# Altium schematic sheet lab3_kozlov_motherboard.SchDoc: =title_line_1 + title_line_2
size 840 x 594 mm; SheetNumber: n
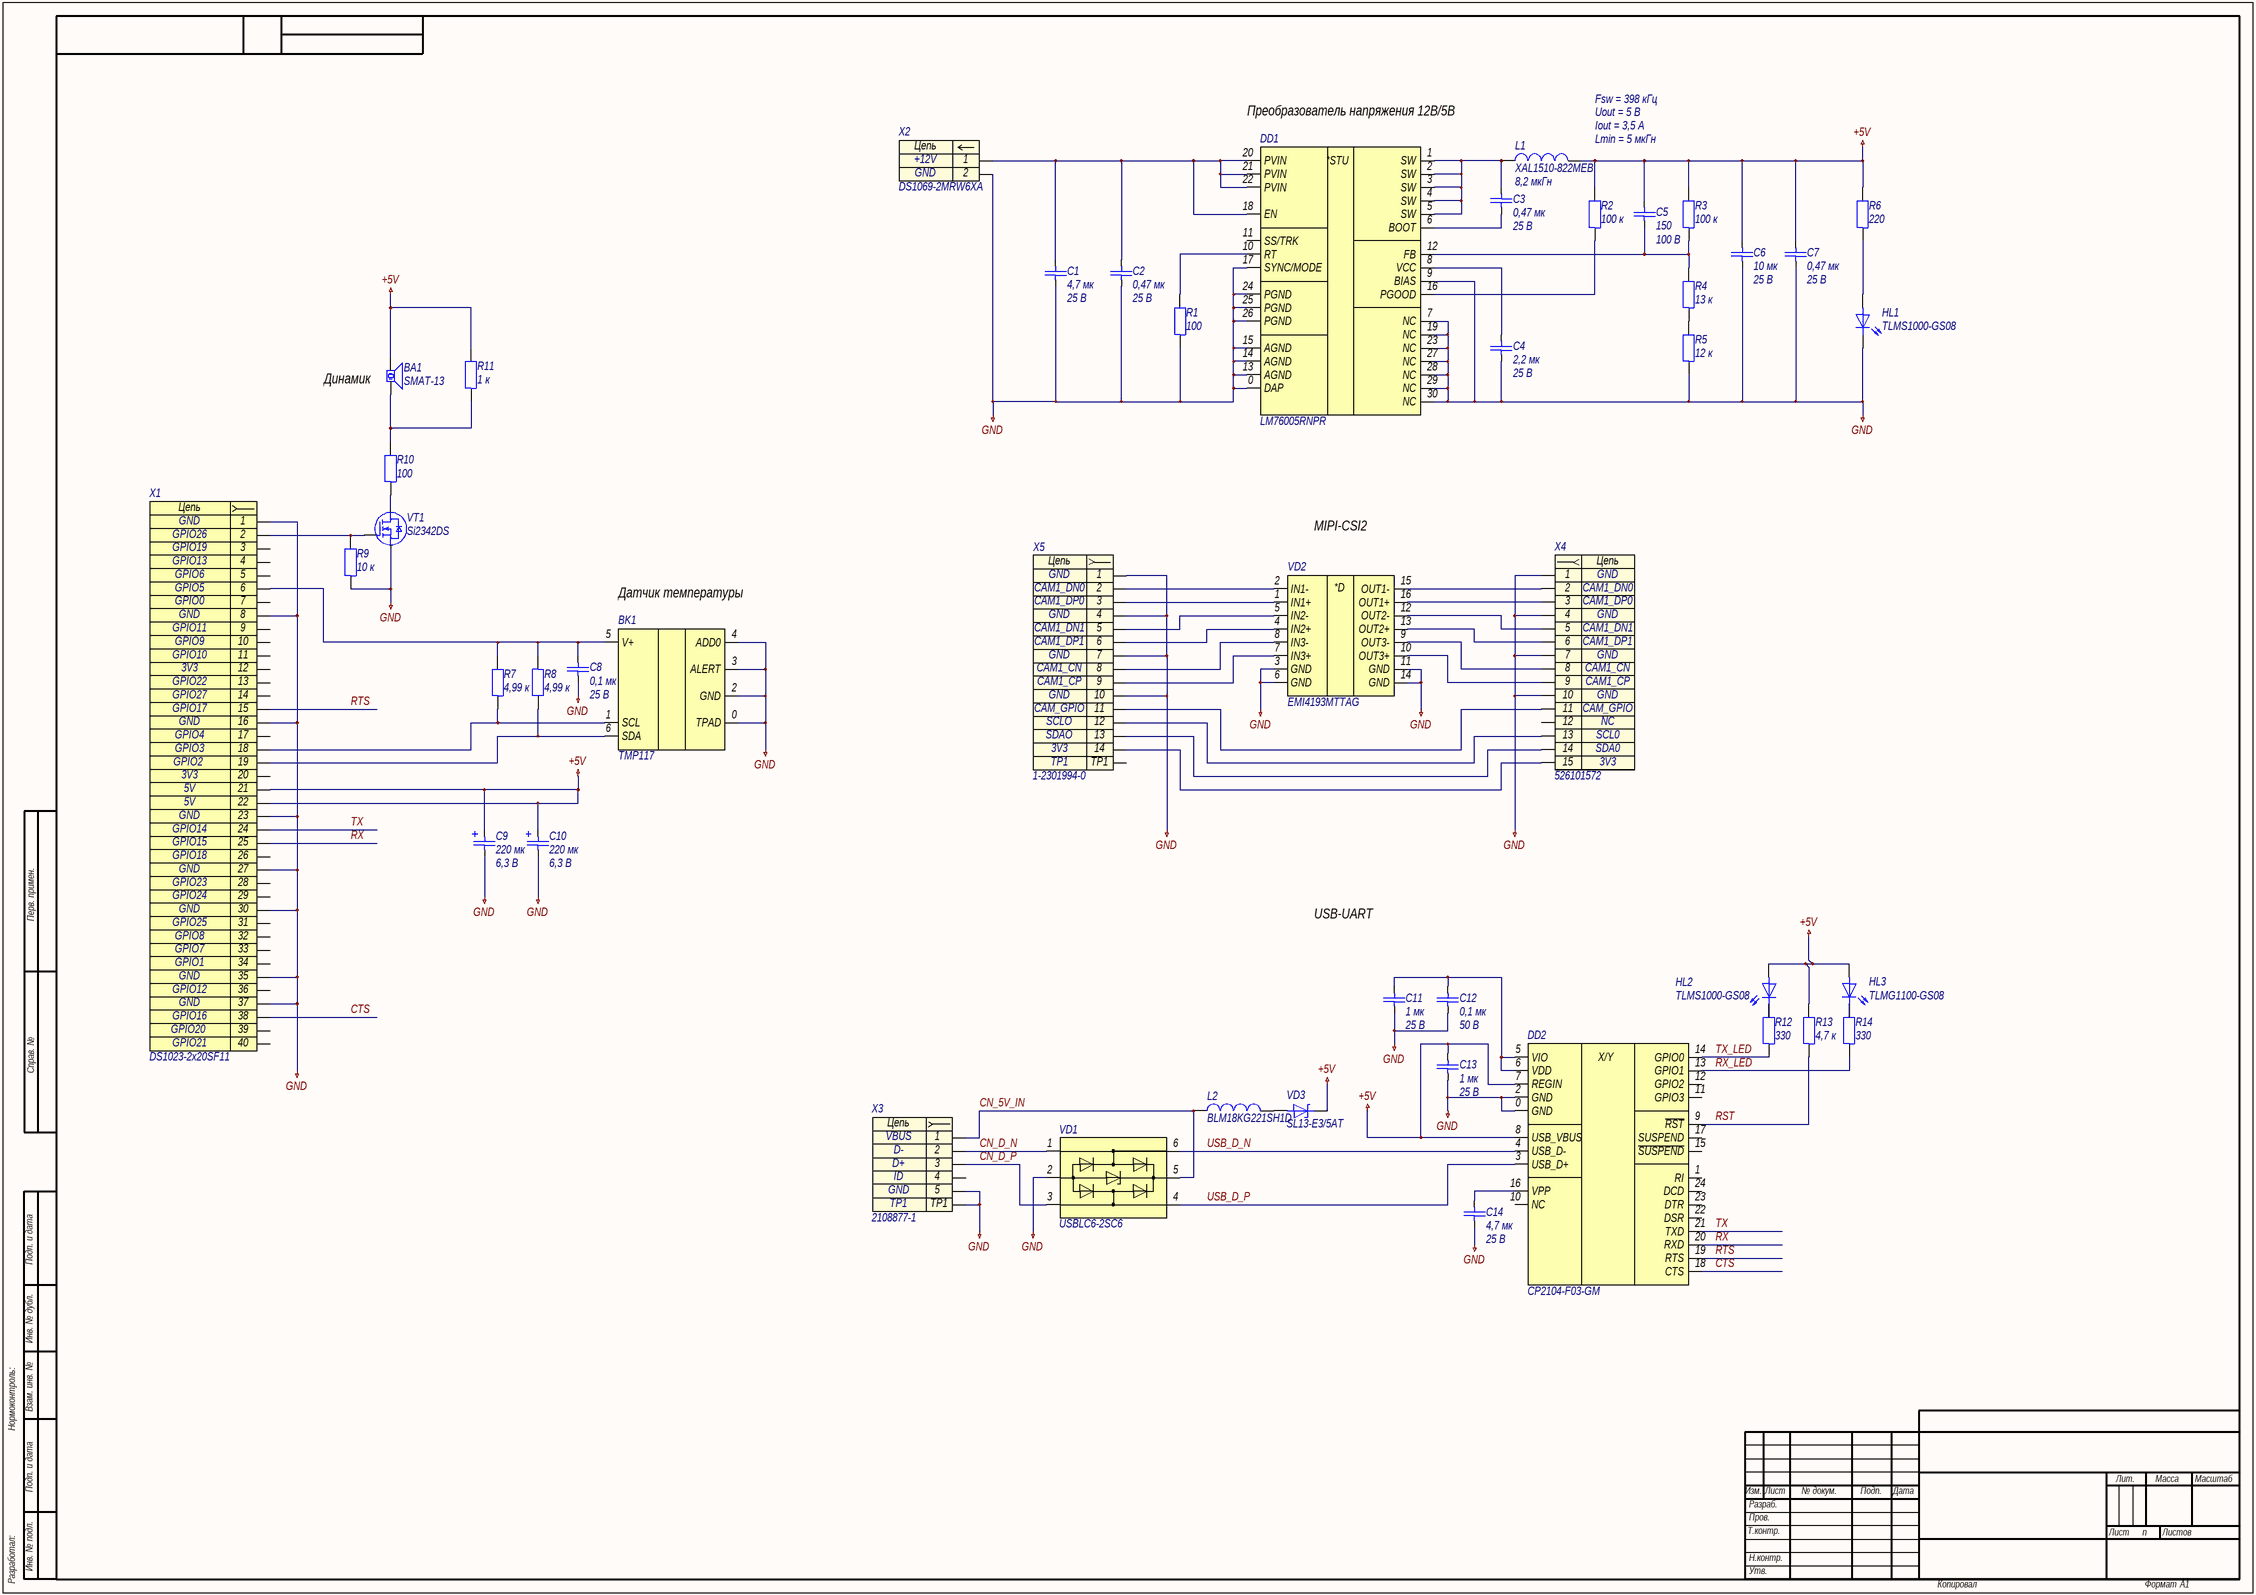
[diagram p0: lab3_kozlov_motherboard.SchDoc]

## Parts
BA1  SMAT-13  [SMAT_13]
BK1  TMP117  [TMP117]
C1  4,7 мк  Напряжение: 25 В  [C0805]
C2  0,47 мк  Напряжение: 25 В  [C0603]
C3  0,47 мк  Напряжение: 25 В  [C0603]
C4  2,2 мк  Напряжение: 25 В  [C0805]
C5  150  Напряжение: 100 В  [C0805]
C6  10 мк  Напряжение: 25 В  [C1206]
C7  0,47 мк  Напряжение: 25 В  [C0603]
C8  0,1 мк  Напряжение: 25 В  [C0402]
C9  220 мк  Напряжение: 6,3 В  [C7343-43]
C10  220 мк  Напряжение: 6,3 В  [C7343-43]
C11  1 мк  Напряжение: 25 В  [C0603]
C12  0,1 мк  Напряжение: 50 В  [C0603]
C13  1 мк  Напряжение: 25 В  [C0603]
C14  4,7 мк  Напряжение: 25 В  [C0603]
DD1  LM76005RNPR  [WQFN-30-P50-600X400X80-L55X25-T460X220]
DD2  CP2104-F03-GM  [QFN-24-P50-400X400X80-L40X25-T270X270]
HL1  TLMS1000-GS08  [HL0603]
HL2  TLMS1000-GS08  [HL0603]
HL3  TLMG1100-GS08  [HL0603]
L1  XAL1510-822MEB  Индуктивность: 8,2 мкГн  [XAL-2-1620X1520X1000]
L2  BLM18KG221SH1D  [BLM-2-0603]
R1  100  [R0603]
R2  100 к  [R0603]
R3  100 к  [R0603]
R4  13 к  [R0603]
R5  12 к  [R0603]
R6  220  [R0603]
R7  4,99 к  [R0603]
R8  4,99 к  [R0603]
R9  10 к  [R0603]
R10  100  [R0603]
R11  1 к  [R0603]
R12  330  [R0603]
R13  4,7 к  [R0603]
R14  330  [R0603]
VD1  USBLC6-2SC6  [SOT-23-6-P95-290X280X145]
VD2  EMI4193MTTAG  [EMI4193]
VD3  SL13-E3/5AT  [DO-214AC-510X270X229]
VT1  Si2342DS  [SOT95P237X112-3N]
X1  DS1023-2x20SF11  [DS1023-2X20SF11]
X2  DS1069-2MRW6XA  [DS1069-2MRW6XA]
X3  2108877-1  [2108877-1]
X4  526101572  [526101572]
X5  1-2301994-0  [1-2301994-0]

## Nets
+5V: BA1.1 C5.1 C6.1 C7.1 C9.1 C10.1 C13.1 DD2.7(REGIN) DD2.8(USB_VBUS) HL2.2 HL3.2 L1.2 R2.2 R3.2 R6.2 R11.2 R13.2 VD3.1 X1.21 X1.22
GND: BK1.0(TPAD) BK1.2(GND) BK1.3(ALERT) BK1.4(ADD0) C1.2 C2.2 C4.2 C6.2 C7.2 C8.2 C9.2 C10.2 C11.2 C12.2 C13.2 C14.2 DD1.0(DAP) DD1.7(NC) DD1.9(BIAS) DD1.13(AGND) DD1.14(AGND) DD1.15(AGND) DD1.17(SYNC/MODE) DD1.19(NC) DD1.23(NC) DD1.24(PGND) DD1.25(PGND) DD1.26(PGND) DD1.27(NC) DD1.28(NC) DD1.29(NC) DD1.30(NC) DD2.0(GND) DD2.2(GND) HL1.1 R1.1 R5.1 R9.1 VD1.2 VD2.3(GND) VD2.6(GND) VD2.11(GND) VD2.14(GND) VT1.S X1.1 X1.8 X1.16 X1.23 X1.27 X1.30 X1.35 X1.37 X2.2 X3.5 X3.TP1 X4.1 X4.4 X4.7 X4.10 X5.1 X5.4 X5.7 X5.10
CN_5V_IN: L2.1 VD1.5 X3.1
CN_D_N: VD1.1 X3.2
CN_D_P: VD1.3 X3.3
CTS: DD2.18(CTS) X1.38
RST: DD2.9(~{RST}) R13.1
RTS: DD2.19(RTS) X1.15
RX: DD2.20(RXD) X1.25
RX_LED: DD2.13(GPIO1) R14.1
TX: DD2.21(TXD) X1.24
TX_LED: DD2.14(GPIO0) R12.1
USB_D_N: DD2.4(USB_D-) VD1.6
USB_D_P: DD2.3(USB_D+) VD1.4
NetBA1_2: BA1.2 R10.2 R11.1
NetBK1_1: BK1.1(SCL) R7.1 X1.18
NetBK1_5: BK1.5(V+) C8.1 R7.2 R8.1 X1.6
NetBK1_6: BK1.6(SDA) R8.2 X1.19
NetC1_1: C1.1 C2.1 DD1.18(EN) DD1.20(PVIN) DD1.21(PVIN) DD1.22(PVIN) X2.1
NetC3_1: C3.1 DD1.6(BOOT)
NetC3_2: C3.2 DD1.1(SW) DD1.2(SW) DD1.3(SW) DD1.4(SW) DD1.5(SW) L1.1
NetC4_1: C4.1 DD1.8(VCC)
NetC5_2: C5.2 DD1.12(FB) R3.1 R4.2
NetC11_1: C11.1 C12.1 DD2.5(VIO) DD2.6(VDD)
NetC14_1: C14.1 DD2.16(VPP)
NetDD1_10: DD1.10(RT) R1.2
NetDD1_16: DD1.16(PGOOD) R2.1
NetHL1_2: HL1.2 R6.1
NetHL2_1: HL2.1 R12.2
NetHL3_1: HL3.1 R14.2
NetL2_2: L2.2 VD3.2
NetR4_1: R4.1 R5.2
NetR9_2: R9.2 VT1.G X1.2
NetR10_1: R10.1 VT1.D
NetVD2_1: VD2.1(IN1+) X5.3
NetVD2_2: VD2.2(IN1-) X5.2
NetVD2_4: VD2.4(IN2+) X5.6
NetVD2_5: VD2.5(IN2-) X5.5
NetVD2_7: VD2.7(IN3+) X5.9
NetVD2_8: VD2.8(IN3-) X5.8
NetVD2_9: VD2.9(OUT3-) X4.8
NetVD2_10: VD2.10(OUT3+) X4.9
NetVD2_12: VD2.12(OUT2-) X4.5
NetVD2_13: VD2.13(OUT2+) X4.6
NetVD2_15: VD2.15(OUT1-) X4.2
NetVD2_16: VD2.16(OUT1+) X4.3
NetX4_11: X4.11 X5.11
NetX4_13: X4.13 X5.12
NetX4_14: X4.14 X5.13
NetX4_15: X4.15 X5.14

Not connected (* = marked no-connect by the designer): DD1 11(SS/TRK); DD2 1(RI) 10(NC) 11(GPIO3) 12(GPIO2) 15(~{SUSPEND}) 17(SUSPEND) 22(DSR) 23(DTR) 24(DCD); X1 3 4 5 7 9 10 11 12 13 14 17 20 26 28 29 31 32 33 34 36 39 40; X3 4; X4 12; X5 TP1

## Notes on the sheet
- Fsw = 398 кГц
- Преобразователь напряжения 12В/5В
- Uout = 5 В
- Iout = 3,5 А
- Lmin = 5 мкГн
- (near BA1) Динамик
- MIPI-CSI2
- Датчик температуры
- USB-UART
- Перв. примен.
- Справ. №
- Подп. и дата
- Инв. № дубл.
- Нормоконтроль:
- Взам. инв. №
- Изм.
- Лист
- № докум.
- Подп.
- Дата
- Лит.
- Масса
- Масштаб
- Т.контр.
- Пров.
- Разраб.
- Листов
- Разработал:
- Инв. № подл.
- Н.контр.
- Утв.
- Копировал
- Формат
- А1
- (in symbol 526101572) Цепь
- (in symbol dd0001) X/Y
- (in symbol dd0014) *STU
- (in symbol EMI4193) *D
- (in symbol x0001) Цепь
- (in symbol x0016) Цепь
- (in symbol x0038) Цепь
- (in symbol x0040) Цепь

## Library data of the parts
BA1 = PIEZO_SOUNDER: https://www.sonitron.be/products/sma-smat-series/
BK1 = TMP117: https://www.ti.com/product/TMP117#design-development##hardware-development
C1 = c0137: =Описание; ID: c0137; Фамилия: Паньков; Описание: Конденсатор керамический чип 0805 4,7 мкФ 25 В ±10 %; Наименование: CC0805KKX7R8BB475; Производитель: YAGEO Corp.; Отклонение: ±10 %; Рабочие температуры: от –55 °С до +125 °С; Температурный коэффициент емкости: X7R; Корпус: 0805; Номинал: 4,7 мк; Номинальное напряжение: 25 В; HelpURL: https://www.yageo.com/upload/media/product/productsearch/datasheet/mlcc/UPY-GPHC_X7R_6.3V-to-50V_20.pdf
C2 C3 C7 = c0104: =Описание; ID: c0104; Фамилия: Паньков; Описание: Конденсатор керамический чип 0603 470 нФ 25 В ±10 %; Наименование: CC0603KRX5R8BB474; Производитель: YAGEO Corp.; Отклонение: ±10 %; Рабочие температуры: от –55 °С до +85 °С; Температурный коэффициент емкости: X5R; Корпус: 0603; Номинал: 0,47 мк; Номинальное напряжение: 25 В; HelpURL: https://www.yageo.com/upload/media/product/productsearch/datasheet/mlcc/UPY-GPHC_X5R_4V-to-50V_26.pdf
C4 = c0126: =Описание; ID: c0126; Фамилия: Паньков; Описание: Конденсатор керамический чип 0805 2,2 мкФ 25 В ±10 %; Наименование: CC0805KKX7R8BB225; Производитель: YAGEO Corp.; Отклонение: ±10 %; Рабочие температуры: от –55 °С до +125 °С; Температурный коэффициент емкости: X7R; Корпус: 0805; Номинал: 2,2 мк; Номинальное напряжение: 25 В; HelpURL: https://www.yageo.com/upload/media/product/productsearch/datasheet/mlcc/UPY-GPHC_X7R_6.3V-to-50V_20.pdf
C5 = c0177: =Описание; ID: c0177; Фамилия: Ляховский; Описание: Конденсатор керамический чип 0805 150 пФ 100 В ±2 %; Наименование: C0805C151G1GACTU; Производитель: KEMET Corporation; Отклонение: ±2 %; Рабочие температуры: от –55 °С до +125 °С; Температурный коэффициент емкости: C0G; Корпус: 0805; Номинал: 150; Номинальное напряжение: 100 В; HelpURL: https://www.kemet.com/en/us/capacitors/ceramic/product/C0805C151G1GACTU.html
C6 = c0148: =Описание; ID: c0148; Фамилия: Паньков; Описание: Конденсатор керамический чип 1206 10 мкФ 25 В ±10 %; Наименование: CC1206KKX7R8BB106; Производитель: YAGEO Corp.; Отклонение: ±10 %; Рабочие температуры: от –55 °С до +125 °С; Температурный коэффициент емкости: X7R; Корпус: 1206; Номинал: 10 мк; Номинальное напряжение: 25 В; HelpURL: https://www.yageo.com/upload/media/product/productsearch/datasheet/mlcc/UPY-GPHC_X7R_6.3V-to-50V_20.pdf
C8 = c0082: =Описание; ID: c0082; Фамилия: Паньков; Описание: Конденсатор керамический чип 0402 100 нФ 25 В ±10 %; Наименование: CC0402KRX5R8BB104; Производитель: YAGEO Corp.; Отклонение: ±10 %; Рабочие температуры: от –55 °С до +85 °С; Температурный коэффициент емкости: X5R; Корпус: 0402; Номинал: 0,1 мк; Номинальное напряжение: 25 В; HelpURL: https://www.yageo.com/upload/media/product/productsearch/datasheet/mlcc/UPY-GPHC_X5R_4V-to-50V_26.pdf
C9 C10 = c0153: =Описание; ID: c0153; Фамилия: Паньков; Описание: Конденсатор танталовый чип 7343-43 220 мкФ 6,3 В ±10 %; Наименование: 293D227X96R3E2TE3; Производитель: Vishay Intertechnology, Inc.; Отклонение: ±10 %; Эквивалентное последовательное сопротивление: 0,5 Ом; Среднеквадратичный размах пульсации тока: 0,57 А; Рабочие температуры: от –55 °С до +125 °С; Корпус: 7343-43; Номинал: 220 мк; Номинальное напряжение: 6,3 В; HelpURL: https://www.vishay.com/capacitors/list/product-40002/
C11 C13 = c0115: =Описание; ID: c0115; Фамилия: Ларионов; Описание: Конденсатор керамический чип 0603 1 мкФ 25 В ±10 %; Наименование: CC0603KRX7R8BB105; Производитель: YAGEO Corp.; Отклонение: ±10 %; Рабочие температуры: от –55 °С до +125 °С; Температурный коэффициент емкости: X7R; Корпус: 0603; Номинал: 1 мк; Номинальное напряжение: 25 В; HelpURL: https://www.yageo.com/upload/media/product/productsearch/datasheet/mlcc/UPY-GPHC_X7R_6.3V-to-50V_20.pdf
C12 = c0085: =Описание; ID: c0085; Фамилия: Ларионов; Описание: Конденсатор керамический чип 0603 100 нФ 50 В ±5 %; Наименование: CC0603JRX7R9BB104; Производитель: YAGEO Corp.; Отклонение: ±5 %; Рабочие температуры: от –55 °С до +125 °С; Температурный коэффициент емкости: X7R; Корпус: 0603; Номинал: 0,1 мк; Номинальное напряжение: 50 В; HelpURL: https://www.yageo.com/upload/media/product/productsearch/datasheet/mlcc/UPY-GPHC_X7R_6.3V-to-50V_20.pdf
C14 = c0136: =Описание; ID: c0136; Фамилия: Ларионов; Описание: Конденсатор керамический чип 0603 4,7 мкФ 25 В ±10 %; Наименование: CC0603KRX5R8BB475; Производитель: YAGEO Corp.; Отклонение: ±10 %; Рабочие температуры: от –55 °С до +85 °С; Температурный коэффициент емкости: X5R; Корпус: 0603; Номинал: 4,7 мк; Номинальное напряжение: 25 В; HelpURL: https://www.yageo.com/upload/media/product/productsearch/datasheet/mlcc/UPY-GPHC_X5R_4V-to-50V_26.pdf
DD1 = dd0014: =Описание; ID: dd0014; Фамилия: Водорезов; Описание: Понижающий преобразователь напряжения 3,5…60 В / 1,0…57 В и 5,0 А; Производитель: Texas Instruments Inc.; Входное напряжение: от 3,5 В до 60 В; Выходное напряжение: от 1,0 В до 57 В; Коммутируемый ток: до 5,0 А; Частота переключения: от 200 кГц до 500 кГц; Рабочие температуры: от –40 °С до +125 °С; Корпус: WQFN-30; Наименование: LM76005RNPR; HelpURL: https://www.ti.com/product/LM76005
DD2 = dd0001: =Описание; ID: dd0001; Фамилия: Ларионов; Описание: Преобразователь USB-UART; Производитель: Silicon Laboratories; Рабочие температуры: от –40 до +85 °C; Корпус: QFN-24; Наименование: CP2104-F03-GM; HelpURL: https://www.silabs.com/interface/usb-bridges/classic/device.cp2104
HL1 = hl0001: =Описание; ID: hl0001; Фамилия: Ларионов; Описание: Светодиод чип 0603 красный; Производитель: Vishay Intertechnology, Inc.; Цвет: Red; Номинальная сила света: 4 мкд; Номинальная длина волны: 628 нм; Номинальный прямой ток: 15 мА; Номинальное падение напряжения: 1,8 В; Рассеиваемая мощность: 40 мВт; Рабочие температуры: от -40 °С до +100 °С; Корпус: 0603; Наименование: TLMS1000-GS08; HelpURL: https://www.vishay.com/leds/list/product-83172/
HL2 = hl0001: =Описание; ID: hl0001; Фамилия: Ларионов; Описание: Светодиод чип 0603 красный; Производитель: Vishay Intertechnology, Inc.; Цвет: Red; Номинальная сила света: 4 мкд; Номинальная длина волны: 628 нм; Номинальный прямой ток: 15 мА; Номинальное падение напряжение: 1,8 В; Рассеиваемая мощность: 40 мВт; Рабочие температуры: от -40 °С до +100 °С; Корпус: 0603; Наименование: TLMS1000-GS08; HelpURL: https://www.vishay.com/leds/list/product-83172/
HL3 = hl0005: =Описание; ID: hl0005; Фамилия: Ларионов; Описание: Светодиод чип 0603 зеленый; Производитель: Vishay Intertechnology, Inc.; Цвет: Green; Номинальная сила света: 35 мкд; Номинальная длина волны: 570 нм; Номинальный прямой ток: 30 мА; Номинальное падение напряжение: 2,1 В; Рассеиваемая мощность: 90 мВт; Рабочие температуры: от -40 °С до +100 °С; Корпус: 0603; Наименование: TLMG1100-GS08; HelpURL: https://www.vishay.com/leds/list/product-83173/
L1 = l0005: =Описание; ID: l0005; Фамилия: Паньков; Описание: Катушка индуктивности 8,2 мкГн ±20 %; Производитель: Coilcraft, Inc.; Отклонение: ±20 %; Номинальное активное сопротивление: 6 мОм; Максимальное активное сопротивление: 7,5 мОм; Резонансная частота: 10,8 МГц; Номинальный ток (при нагреве на 20 °С/40 °С): 18 А; Ток насыщения: 30 А; Рабочее напряжение: от 0 В до 60 В; Рабочие температуры: от –40 °С до +125 °С; Корпус: 16,2 x 15,2 x 10; Наименование: XAL1510-822MEB; Номинал: 8,2 мкГн; HelpURL: https://www.coilcraft.com/en-us/products/power/shielded-inductors/molded-inductor/xal/xal1510
L2 = l0001: =Описание; ID: l0001; Фамилия: Ларионов; Описание: Ферритовая бусина 220 Ом ±25 %; Производитель: Murata Manufacturing Co., Ltd.; Сопротивление, 100 МГц: 220 Ом; Отклонение, 100 МГц: ±25 %; Сопротивление при постоянном токе: 0,05 Ом; Рабочие температуры: от –55 °С до +125 °С; Корпус: 0603; Наименование: BLM18KG221SH1D; HelpURL: https://www.murata.com/en-global/products/productdetail?partno=BLM18KG221SH1%23
R1 R10 = r0052: =Описание; ID: r0052; Фамилия: Самарин; Описание: Резистор чип 0603 100 Ом ±1 % 0,1 Вт; Наименование: RC0603FR‍‐07100RL; Производитель: YAGEO Corp.; Отклонение: ±1 %; Номинальное напряжение: 75 В; Номинальный ток: 1 А; Рабочие температуры: от –55 °С до +155 °С; Корпус: 0603; Примечание: Ряд E24; Номинал: 100; HelpURL: https://www.yageo.com/upload/media/product/productsearch/datasheet/rchip/PYu-RC_Group_51_RoHS_L_11.pdf
R2 R3 = r0023: =Описание; ID: r0023; Фамилия: Водорезов; Описание: Резистор чип 0603 100 кОм ±1 % 0,2 Вт; Наименование: RC0603FR-07100KL; Производитель: YAGEO Corp.; Отклонение: ±1 %; Номинальное напряжение: 75 В; Рабочие температуры: от -55 °С до +155 °С; Номинальный ток: 1 А; Корпус: 0603; Номинал: 100 к; HelpURL: https://www.yageo.com/upload/media/product/productsearch/datasheet/rchip/PYu-RC_Group_51_RoHS_L_11.pdf
R4 = r0016: =Описание; ID: r0016; Фамилия: Жернаков; Описание: Резистор чип 0603 13 кОм ±1 % 0,1 Вт; Наименование: RC0603FR-0713KL; Производитель: YAGEO Corp.; Отклонение: ±1 %; Номинальное напряжение: 75 В; Рабочие температуры: от -55 °С до +155 °С; Номинальный ток: 1 А; Корпус: 0603; Номинал: 13 к; HelpURL: https://www.yageo.com/upload/media/product/productsearch/datasheet/rchip/PYu-RC_Group_51_RoHS_L_11.pdf
R5 = r0015: =Описание; ID: r0015; Фамилия: Соколов; Описание: Резистор чип 0603 12 кОм ±1 % 0,1 Вт; Наименование: AC0603FR-1012KL; Производитель: YAGEO Corp.; Отклонение: ±1 %; Номинальное напряжение: 75 В; Рабочие температуры: от -55 °С до +155 °С; Номинальный ток: 1 А; Корпус: 0603; Номинал: 12 к; HelpURL: https://www.yageo.com/upload/media/product/productsearch/datasheet/rchip/PYu-AC_51_RoHS_L_7.pdf
R6 = r0009: =Описание; ID: r0009; Фамилия: Ларионов; Описание: Резистор чип 0603 220 Ом ±1 % 0,1 Вт; Наименование: RC0603FR-07220RL; Производитель: YAGEO Corp.; Отклонение: ±1 %; Номинальное напряжение: 75 В; Рабочие температуры: от -55 °С до +155 °С; Номинальный ток: 1 А; Корпус: 0603; Номинал: 220; HelpURL: https://www.yageo.com/upload/media/product/productsearch/datasheet/rchip/PYu-RC_Group_51_RoHS_L_11.pdf
R7 R8 = r0095: =Описание; ID: r0095; Фамилия: Жернаков; Описание: Резистор чип 0603 4,99 кОм ±1 % 0,1 Вт; Наименование: RC0603FR-074K99L; Производитель: YAGEO Corp.; Отклонение: ±1 %; Номинальное напряжение: 75 В; Номинальный ток: 1 А; Рабочие температуры: от –55 °С до +155 °С; Корпус: 0603; Номинал: 4,99 к; HelpURL: https://www.yageo.com/upload/media/product/productsearch/datasheet/rchip/PYu-RC_Group_51_RoHS_L_11.pdf
R9 = r0105: =Описание; ID: r0105; Фамилия: Самарин; Описание: Резистор чип 0603 10 кОм ±1 % 0,1 Вт; Наименование: RC0603FR-0710KL; Производитель: YAGEO Corp.; Отклонение: ±1 %; Номинальное напряжение: 75 В; Номинальный ток: 1 А; Рабочие температуры: от –55 °С до +155 °С; Корпус: 0603; Примечание: Ряд E24; Номинал: 10 к; HelpURL: https://www.yageo.com/upload/media/product/productsearch/datasheet/rchip/PYu-RC_Group_51_RoHS_L_11.pdf
R11 = r0076: =Описание; ID: r0076; Фамилия: Ларионов; Описание: Резистор чип 0603 1 кОм ±1 % 0,1 Вт; Наименование: RC0603FR-071KL; Производитель: YAGEO Corp.; Отклонение: ±1 %; Номинальное напряжение: 75 В; Номинальный ток: 1 А; Рабочие температуры: от –55 °С до +155 °С; Корпус: 0603; Примечание: Ряд E24; Номинал: 1 к; HelpURL: https://www.yageo.com/upload/media/product/productsearch/datasheet/rchip/PYu-RC_Group_51_RoHS_L_11.pdf
R12 R14 = r0005: =Описание; ID: r0005; Фамилия: Ларионов; Описание: Резистор чип 0603 330 Ом ±1 % 0,1 Вт; Наименование: RC0603FR-07330RL; Производитель: Yageo; Отклонение: ±1 %; Номинальное напряжение: 75 В; Рабочие температуры: от -55 °С до +155 °С; Номинальный ток: 1 А; Корпус: 0603; Номинал: 330; HelpURL: https://www.yageo.com/upload/media/product/productsearch/datasheet/rchip/PYu-RC_Group_51_RoHS_L_11.pdf
R13 = r0006: =Описание; ID: r0006; Фамилия: Ларионов; Описание: Резистор чип 0603 4,7 кОм ±1 % 0,1 Вт; Наименование: RC0603FR-074K7L; Производитель: Yageo; Отклонение: ±1 %; Номинальное напряжение: 75 В; Рабочие температуры: от -55 °С до +155 °С; Номинальный ток: 1 А; Корпус: 0603; Номинал: 4,7 к; HelpURL: https://www.yageo.com/upload/media/product/productsearch/datasheet/rchip/PYu-RC_Group_51_RoHS_L_11.pdf
VD1 = vd0011: =Описание; ID: vd0011; Фамилия: Ларионов; Описание: Диодная сборка для подавления помех от 6 В; Производитель: STMicroelectronics; Корпус: SOT-23-6; Наименование: USBLC6-2SC6; HelpURL: https://www.st.com/content/st_com/en/products/protection-devices/esd-protection/usb-port-protection/usblc6-2.html
VD2 = EMI4193: https://www.onsemi.com/products/isolation-protection-devices/emi-filters/emi4193
VD3 = vd0003: =Описание; ID: vd0003; Фамилия: Ларионов; Описание: Диод Шоттки 30 В 1,5 А; Производитель: Vishay Intertechnology, Inc.; Максимальное прямое напряжение: 0,445 В; Максимальное обратное напряжение: 30 В; Максимальный прямой ток: 1,5 А; Рабочие температуры: от –55 °С до +125 °С; Корпус: DO-214AC; Наименование: SL13-E3/5AT; HelpURL: https://www.vishay.com/product?docid=88740
VT1 = vt0008: =Описание; ID: vt0008; Фамилия: Козлов; Описание: Полевой N-канальный МДП-транзистор 8 В 6 А; Производитель: Vishay Intertechnology, Inc.; Напряжение затвор — исток: ±5 В; Напряжение сток — исток: 8 В; Ток стока: 6 А; Сопротивление сток — исток: 17 мОм; Рабочие температуры: от –55 °С до +150 °С; Корпус: SOT-23-3; Наименование: Si2342DS; HelpURL: https://www.vishay.com/mosfets/list/product-63302/
X1 = x0038: =Описание; Contact_1: GND; Contact_2: GPIO26; Contact_3: GPIO19; Contact_4: GPIO13; Contact_5: GPIO6; Contact_6: GPIO5; Contact_7: GPIO0; Contact_9: GPIO11; Contact_10: GPIO9; Contact_11: GPIO10; Contact_12: 3V3; Contact_13: GPIO22; Contact_14: GPIO27; Contact_15: GPIO17; Contact_17: GPIO4; Contact_18: GPIO3; Contact_19: GPIO2; Contact_21: 5V; Contact_24: GPIO14; Contact_25: GPIO15; Contact_26: GPIO18; Contact_28: GPIO23; Contact_29: GPIO24; Contact_31: GPIO25; Contact_32: GPIO8; Contact_33: GPIO7; Contact_34: GPIO1; Contact_36: GPIO12; Contact_38: GPIO16; Contact_39: GPIO20; Contact_40: GPIO21; ID: x0038; Фамилия: Паньков; Описание: PBD 40 pin 2,54 мм гнездо прямой; Производитель: Connfly Electronic Co., Ltd.; Contact_8: GND; Contact_16: GND; Contact_20: 3V3; Contact_22: 5V; Contact_23: GND; Contact_27: GND; Contact_30: GND; Contact_35: GND; Contact_37: GND; Наименование: DS1023-2x20SF11; HelpURL: http://en.connfly.group/product/xVkr=EusQssAN0gN=Aos=mU+UrVkR9kqEAN0gN0AUCUNB+A
X2 = x0040: =Описание; Contact_1: +12V; Contact_2: GND; ID: x0040; Фамилия: Паньков; Описание: CWF 2 pin Type A 2,5 мм вилка угловой; Производитель: Connfly Electronic Co., Ltd.; Наименование: DS1069-2MRW6XA; HelpURL: http://en.connfly.group/product/xVkr=EusQssAN0gN=Aos=mU+UrVkR9kqEAN0gN0MUR+g+NB+A
X3 = x0001: Contact_1: VBUS; Contact_2: D-; Contact_3: D+; Contact_4: ID; Contact_5: GND; ID: x0001; Фамилия: Ларионов; Описание: USB 2.0 Micro USB Type B IP68 гнездо прямой угол; Производитель: TE Connectivity; Наименование: 2108877-1; HelpURL: https://www.te.com/global-en/product-2108877-1.html
X4 = 526101572: https://www.molex.com/molex/products/part-detail/ffc_fpc_connectors/0526101572; Contact_1: GND; Contact_2: CAM1_DN0; Contact_3: CAM1_DP0; Contact_5: CAM1_DN1; Contact_6: CAM1_DP1; Contact_8: CAM1_CN; Contact_9: CAM1_CP; Contact_11: CAM_GPIO; Contact_12: NC; Contact_13: SCL0; Contact_14: SDA0; Contact_15: 3V3; Contact_4: GND; Contact_7: GND; Contact_10: GND
X5 = x0016: =Описание; Contact_1: GND; Contact_2: CAM1_DN0; Contact_3: CAM1_DP0; Contact_5: CAM1_DN1; Contact_6: CAM1_DP1; Contact_8: CAM1_CN; Contact_9: CAM1_CP; Contact_11: CAM_GPIO; Contact_12: SCLO; Contact_13: SDAO; Contact_14: 3V3; ID: x0016; Фамилия: Ларионов; Описание: RJ45 интегрированный трансформатор 1 Gbps LED гнездо угловой; Производитель: TE Connectivity; Contact_4: GND; Contact_7: GND; Contact_10: GND; TP1: TP1; Наименование: 1-2301994-0; HelpURL: https://www.te.com/usa-en/product-1-2301994-0.html?source=header-match